# Altium schematic sheet 100_MCU.SchDoc
size A4; SheetNumber: 2; SheetTotal: 5
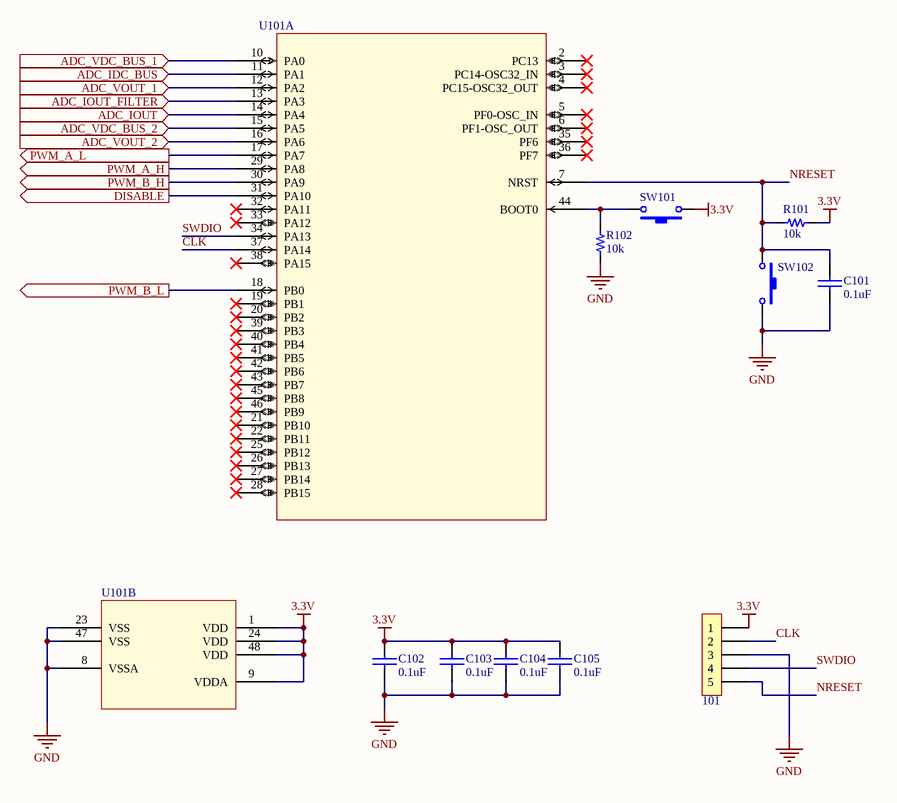
[diagram p0: 100_MCU.SchDoc]

## Parts
101  (no value)  [H_5x1_TH_100mil]  (no BOM)
C101  value 0.1uF  [0603_cap]
C102  0.1uF  [0603_cap]
C103  0.1uF  [0603_cap]
C104  0.1uF  [0603_cap]
C105  0.1uF  [0603_cap]
R101  value 10k  [0603_res]
R102  value 10k  [0603_res]  (hidden comment: 10k 1/10W)
SW101  (no value)  [Sw_PUSH_4.5x4.5x5mm]
SW102  (no value)  [Sw_PUSH_4.5x4.5x5mm]
U101  (no value)  [LQFP48_7x7mm]  (parts A,B of 2)

## Ports
ADC_IDC_BUS (in), ADC_IOUT (in), ADC_IOUT_FILTER (in), ADC_VDC_BUS_1 (in), ADC_VDC_BUS_2 (in), ADC_VOUT_1 (in), ADC_VOUT_2 (in), DISABLE (out), PWM_A_H (out), PWM_A_L (out), PWM_B_H (out), PWM_B_L (out)

## Nets
3.3V: 101.1 C102.1 C103.1 C104.1 C105.1 R101.2 SW101.1 U101.1(VDD) U101.9(VDDA) U101.24(VDD) U101.48(VDD)
GND: 101.3 C101.2 C102.2 C103.2 C104.2 C105.2 R102.1 SW102.2 U101.8(VSSA) U101.23(VSS) U101.47(VSS)
ADC_IDC_BUS: U101.11(PA1) ; port ADC_IDC_BUS
ADC_IOUT: U101.14(PA4) ; port ADC_IOUT
ADC_IOUT_FILTER: U101.13(PA3) ; port ADC_IOUT_FILTER
ADC_VDC_BUS_1: U101.10(PA0) ; port ADC_VDC_BUS_1
ADC_VDC_BUS_2: U101.15(PA5) ; port ADC_VDC_BUS_2
ADC_VOUT_1: U101.12(PA2) ; port ADC_VOUT_1
ADC_VOUT_2: U101.16(PA6) ; port ADC_VOUT_2
CLK: 101.2 U101.37(PA14)
DISABLE: U101.31(PA10) ; port DISABLE
NRESET: 101.5 C101.1 R101.1 SW102.1 U101.7(NRST)
PWM_A_H: U101.29(PA8) ; port PWM_A_H
PWM_A_L: U101.17(PA7) ; port PWM_A_L
PWM_B_H: U101.30(PA9) ; port PWM_B_H
PWM_B_L: U101.18(PB0) ; port PWM_B_L
SWDIO: 101.4 U101.34(PA13)
NetR102_2: R102.2 SW101.2 U101.44(BOOT0)

Not connected (* = marked no-connect by the designer): U101 2(PC13)* 3(PC14-OSC32_IN)* 4(PC15-OSC32_OUT)* 5(PF0-OSC_IN)* 6(PF1-OSC_OUT)* 19(PB1)* 20(PB2)* 21(PB10)* 22(PB11)* 25(PB12)* 26(PB13)* 27(PB14)* 28(PB15)* 32(PA11)* 33(PA12)* 35(PF6)* 36(PF7)* 38(PA15)* 39(PB3)* 40(PB4)* 41(PB5)* 42(PB6)* 43(PB7)* 45(PB8)* 46(PB9)*

## Library data of the parts
101 = H_Male_5x1_TH_100mil: ComponentLink1Description: LCSC
C101 = Cap_0.1uF_0603_50V: 50V 100nF Y5V -20%~+80% 0603 Multilayer Ceramic Capacitors MLCC - SMD/SMT ROHS; Manufacturer: Walsin Tech Corp; Manufacturer Part Number: 0603F104Z500CT; Supplier 1: LCSC; Supplier Part Number 1: C83060; ComponentLink1Description: LCSC; ComponentLink1URL: https://www.lcsc.com/product-detail/Multilayer-Ceramic-Capacitors-MLCC-SMD-SMT_Walsin-Tech-Corp-0603F104Z500CT_C83060.html
C102-C105 = Cap_0.1uF_0603_50V: CAP CER 100nF 50V Y5V 0603; Manufacturer: FOJAN; Manufacturer Part Number: FCC0603F104Z500CT; Supplier 1: LCSC; Supplier Part Number 1: C5137469; ComponentLink1Description: LCSC; ComponentLink1URL: https://www.lcsc.com/product-detail/C5137469.html?s_z=n_q_0603F104Z500CT&spm=wm.fly.bg.2.xh&lcsc_vid=Q1QLUFRRTgRfUVdSQAVWUgVQT1JdUlwFE1MMV1EEQgAxVlNRTlhfUFBXRlRXUTsOAxUeFF5JWBYZEEoKFBINSQcJGk4eFQsCAgIaSgADAwAHC0slTldfUldfWQkaCgg%3D; Value: 0.1uF
R101 R102 = Res_10k_0603_1/10W: RES SMD 10k OHM 5% 1/10W 0603; Manufacturer: FOJAN; Manufacturer Part Number: FRC0603J103TS; ComponentLink1URL: https://www.lcsc.com/product-detail/Chip-Resistor-Surface-Mount_FOJAN-FRC0603J103TS_C2930027.html; Supplier 1: LCSC; Supplier Part Number 1: C2930027; ComponentLink1Description: LCSC
SW101 SW102 = Sw_PUSH_4.5x4.5x5.0xmm: SWITCH TACTILE SPST-NO 0.05A 12V; Manufacturer: BZCN; Manufacturer Part Number: TSC015A05026A; Supplier 1: LCSC; Supplier Part Number 1: C2888509; Last modified by: N-A.Potosi; Last modified date: 20190222; ComponentLink1Description: LCSC; ComponentLink1URL: https://www.lcsc.com/product-detail/Tactile-Switches_BZCN-TSC015A05026A_C2888509.html
U101 = IC_STM32F030C8T6TR_LQFP48_7x7MM: IC MCU 32BIT 64KB FLASH 48LQFP; Manufacturer: STMicroelectronics; Manufacturer part number: STM32F030C8T6TR; Supplier 1: LCSC; Supplier Part Number 1: C23922; ComponentLink1Description: LCSC; ComponentLink1URL: https://www.lcsc.com/product-detail/ST-Microelectronics_STMicroelectronics-STM32F030C8T6_C23922.html